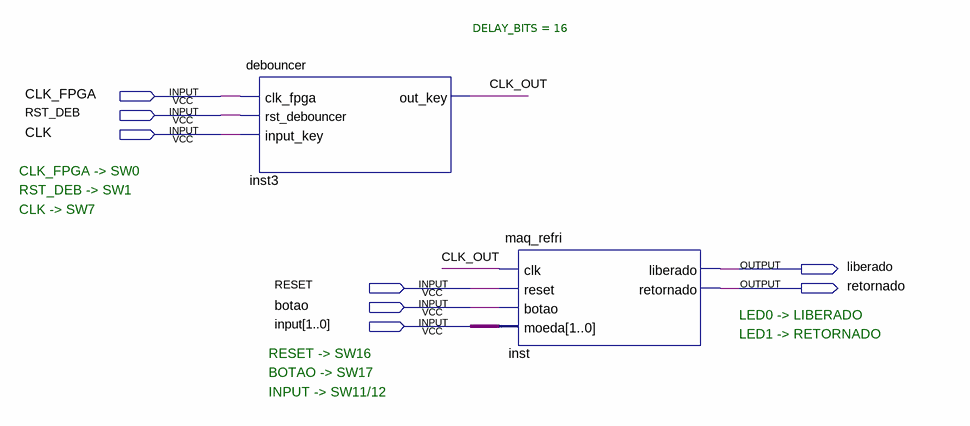
[diagram p0: schematic sheet]
// Quartus schematic bloco_maqRefri.bdf as structural Verilog: 2 symbols, 8 pins
module bloco_maqRefri (
  input  CLK_FPGA,
  input  RST_DEB,
  input  CLK,
  input  RESET,
  input  botao,
  input  [1:0] \input ,
  output liberado,
  output retornado
);

  wire CLK_OUT;

  debouncer #(.DELAY_BITS(16)) inst3 (.clk_fpga(CLK_FPGA), .rst_debouncer(RST_DEB), .input_key(CLK), .out_key(CLK_OUT));
  maq_refri inst (
    .clk(CLK_OUT), .reset(RESET), .botao(botao), .moeda(\input ), .liberado(liberado), .retornado(retornado));

  // Notes on the sheet:
  //   CLK_FPGA -> SW0
  //   RST_DEB -> SW1
  //   CLK -> SW7
  //   LED0 -> LIBERADO
  //   LED1 -> RETORNADO
  //   RESET -> SW16
  //   BOTAO -> SW17
  //   INPUT -> SW11/12
endmodule
